# EAGLE schematic SVI2C (EAGLE 4.09)
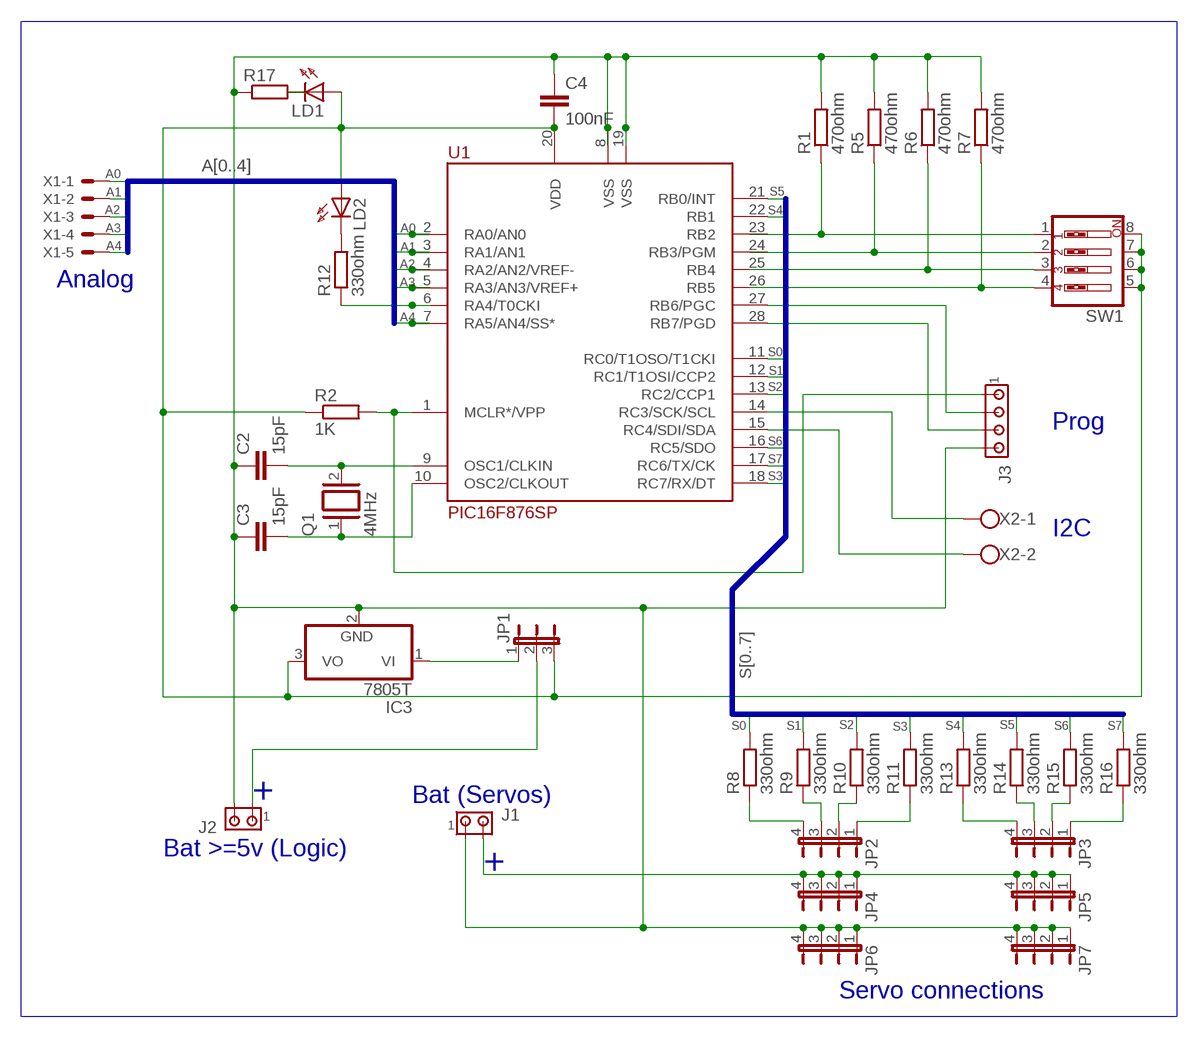
[diagram p0: schematic, sheet 1]

## Parts
C2  15pF  C-EU050-024X044  [C050-024X044]
C3  15pF  C-EU050-024X044  [C050-024X044]
C4  100nF  C2,5-3  [C2.5-3]
IC3  7805T  [TO220H]
J1  MTA02-156  [1X2MTA]
J2  MTA02-100  [10X02MTA]
J3  MTA04-100  [10X04MTA]
JP1  JP2E  [JP2]
JP2  JP4E  [JP4]
JP3  JP4E  [JP4]
JP4  JP4E  [JP4]
JP5  JP4E  [JP4]
JP6  JP4E  [JP4]
JP7  JP4E  [JP4]
LD1  LED5MM  [LED5MM]
LD2  LED3MM  [LED3MM]
Q1  4MHz  XTAL/S  [QS]
R1  470ohm  R-EU_0207/10  [0207/10]
R2  1K  R-EU_0204/7  [0204/7]
R5  470ohm  R-EU_0207/10  [0207/10]
R6  470ohm  R-EU_0207/10  [0207/10]
R7  470ohm  R-EU_0207/10  [0207/10]
R8  330ohm  R-EU_0207/7  [0207/7]
R9  330ohm  R-EU_0207/7  [0207/7]
R10  330ohm  R-EU_0207/7  [0207/7]
R11  330ohm  R-EU_0207/7  [0207/7]
R12  330ohm  R-EU_0204/7  [0204/7]
R13  330ohm  R-EU_0207/7  [0207/7]
R14  330ohm  R-EU_0207/7  [0207/7]
R15  330ohm  R-EU_0207/7  [0207/7]
R16  330ohm  R-EU_0207/7  [0207/7]
R17  R-EU_0207/7  [0207/7]
SW1  SW_DIP-4  [EDG-04]
U1  PIC16F876SP  [DIL28-3]
X1  53047-05  [53047-05]
X2  AK300/2  [AK300/2]

## Nets
A0: U1.2(RA0/AN0) X1.1
A1: U1.3(RA1/AN1) X1.2
A2: U1.4(RA2/AN2/VREF-) X1.3
A3: U1.5(RA3/AN3/VREF+) X1.4
A4: U1.7(RA5/AN4/SS*) X1.5
N$1: U1.14(RC3/SCK/SCL) X2.1
N$2: R1.1 SW1.1 U1.23(RB2)
N$3: R5.1 SW1.2 U1.24(RB3/PGM)
N$4: R6.1 SW1.3 U1.25(RB4)
N$5: R7.1 SW1.4 U1.26(RB5)
N$6: J1.2 JP4.1 JP4.2 JP4.3 JP4.4 JP5.1 JP5.2 JP5.3 JP5.4
N$7: IC3.1(VI) JP1.1
N$8: J2.1 JP1.2
N$9: R12.1 U1.6(RA4/T0CKI)
N$10: LD1.K(C) R17.2
N$11: J3.3 U1.28(RB7/PGD)
N$12: J3.2 U1.27(RB6/PGC)
N$13: JP3.1 R16.1
N$14: JP3.2 R15.1
N$15: JP3.3 R14.1
N$16: JP3.4 R13.1
N$17: JP2.1 R11.1
N$18: JP2.4 R8.1
N$19: JP2.3 R9.1
N$20: C2.2 Q1.2 U1.9(OSC1/CLKIN)
N$21: J3.1 R2.2 U1.1(MCLR*/VPP)
N$22: JP2.2 R10.1
N$24: LD2.K(C) R12.2
N$25: C3.2 Q1.1 U1.10(OSC2/CLKOUT)
N$39: U1.15(RC4/SDI/SDA) X2.2
N$40: C4.2 IC3.3(VO) JP1.3 LD1.A LD2.A R2.1 SW1.5 SW1.6 SW1.7 SW1.8 U1.20(VDD)
S0: R8.2 U1.11(RC0/T1OSO/T1CKI)
S1: R9.2 U1.12(RC1/T1OSI/CCP2)
S2: R10.2 U1.13(RC2/CCP1)
S3: R11.2 U1.18(RC7/RX/DT)
S4: R13.2 U1.22(RB1)
S5: R14.2 U1.21(RB0/INT)
S6: R15.2 U1.16(RC5/SDO)
S7: R16.2 U1.17(RC6/TX/CK)
VSS2: C2.1 C3.1 C4.1 IC3.2(GND) J1.1 J2.2 J3.4 JP6.1 JP6.2 JP6.3 JP6.4 JP7.1 JP7.2 JP7.3 JP7.4 R1.2 R5.2 R6.2 R7.2 R17.1 U1.8(VSS1) U1.19(VSS2)

## Buses
S[0..7]
A[0..4]
B$1

## Notes on the sheet
- Analog
- Prog
- I2C
- + | Bat (Servos)
- Bat >=5v (Logic)
- +
- Servo connections

## Library data of the parts
C2 C3 = rcl:C-EU: CAPACITOR, European symbol
C4 = capacitor-wima:C: CAPACITOR naming: grid - package width
IC3 = linear:78*: Positive VOLTAGE REGULATOR
J1 = con-amp:MTA02-156: AMP connector
J2 = con-amp:MTA02-100: AMP connector
J3 = con-amp:MTA04-100: AMP connector
JP1 = jumper:JP2E: JUMPER
JP2-JP7 = jumper:JP4E: JUMPER
LD1 LD2 = led:LED: LED
Q1 = special:XTAL/S: CRYSTAL
R1 R2 R5-R17 = rcl:R-EU_: RESISTOR, European symbol
SW1 = special:SW_DIP-4: DIP SWITCH
U1 = pic16f87x:PIC16F876: FLASH MICROCONTROLLER
X1 = con-molex:53?-05: CONNECTOR wire to board 1.25 mm (.049 inch) pitch header
X2 = con-ptr500:AK300/2: CONNECTOR